# Altium schematic sheet Sheet1.SchDoc
size A; SheetNumber: 1; SheetTotal: 1
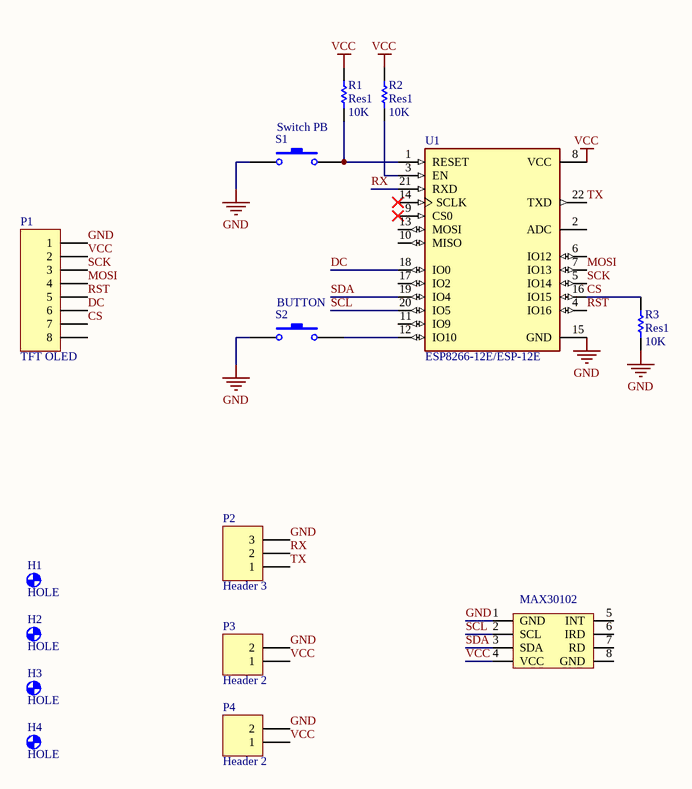
[diagram p0: Sheet1.SchDoc]

## Parts
*1  MAX30102  [PCBComponent_1]  (value not drawn)  (part C of 3)
H1  HOLE  [P3.0]  (no BOM)
H2  HOLE  [P3.0]  (no BOM)
H3  HOLE  [P3.0]  (no BOM)
H4  HOLE  [P3.0]  (no BOM)
P1  TFT OLED  [HDR1X8]
P2  Header 3  [HDR1X3]
P3  Header 2  [HDR1X2]
P4  Header 2  [HDR1X2]
R1  Res1  value 10K  [AXIAL-0.3]
R2  Res1  value 10K  [AXIAL-0.3]
R3  Res1  value 10K  [AXIAL-0.3]
S1  Switch PB  [Switch - Push to On]
S2  BUTTON  [Switch - Push to On]
U1  ESP8266-12E/ESP-12E  [XCVR_ESP8266-12E/ESP-12E]

## Nets
GND: *1.1(GND) P1.1 P2.3 P3.2 P4.2 R3.2 S1.1 S2.1 U1.15(GND)
VCC: *1.4(VCC) P1.2 P3.1 P4.1 R1.1 R2.1 U1.8(VCC)
CS: P1.7 R3.1 U1.16(IO15)
DC: P1.6 U1.18(IO0)
MOSI: P1.4 U1.7(IO13)
RST: P1.5 U1.4(IO16)
RX: P2.2 U1.21(RXD)
SCK: P1.3 U1.5(IO14)
SCL: *1.2(SCL) U1.20(IO5)
SDA: *1.3(SDA) U1.19(IO4)
TX: P2.1 U1.22(TXD)
NetR1_2: R1.2 S1.2 U1.1(RESET)
NetR2_2: R2.2 U1.3(EN)
NetS2_2: S2.2 U1.12(IO10)

Not connected (* = marked no-connect by the designer): *1 5(INT) 6(IRD) 7(RD) 8(GND); P1 8; U1 2(ADC) 6(IO12) 9(CS0)* 10(MISO) 11(IO9) 13(MOSI) 14(SCLK)* 17(IO2)

## Library data of the parts
H1-H4 = MOUNT-HOLE: MOUNTING HOLE with drill center marker
P1 = Header 8: Header, 8-Pin; LatestRevisionDate: 17-Jul-2002; LatestRevisionNote: Re-released for DXP Platform.; Publisher: Altium Limited
P2 = Header 3: Header, 3-Pin; LatestRevisionDate: 17-Jul-2002; LatestRevisionNote: Re-released for DXP Platform.; Publisher: Altium Limited
P3 P4 = Header 2: Header, 2-Pin; LatestRevisionDate: 17-Jul-2002; LatestRevisionNote: Re-released for DXP Platform.; Publisher: Altium Limited
R1-R3 = Res1: Resistor; Published: 8-Jun-2000; LatestRevisionDate: 17-Jul-2002; LatestRevisionNote: Re-released for DXP Platform.; PackageReference: AXIAL-0.3; Publisher: Altium Limited; PackageDescription: Axial Device, Thru-Hole; 2 Leads; 0.3 in Pin Spacing
S1 S2 = Switch PB: Push Button Switch
U1 = ESP8266-12E/ESP-12E: This WiFi module has a 32-bit MCU micro and clock speeds supporting 80 MHz or 160 MHz. Supports the RTOS and integrated Wi-Fi MAC/BB/RF/PA/LNA, and has an on-board antenna.; MF: AI-Thinker; Value: *; SnapEDA_Link: https://www.snapeda.com/parts/ESP8266-12E/ESP-12E/AI-Thinker/view-part/?ref=snap; Availability: Not in stock; Price: None; Package: None; Check_prices: https://www.snapeda.com/parts/ESP8266-12E/ESP-12E/AI-Thinker/view-part/?ref=eda; MP: ESP8266-12E/ESP-12E